# Altium schematic sheet obc-v2_CM4-PinOut.SchDoc
size 420 x 297 mm; SheetNumber: 14; SheetTotal: 21
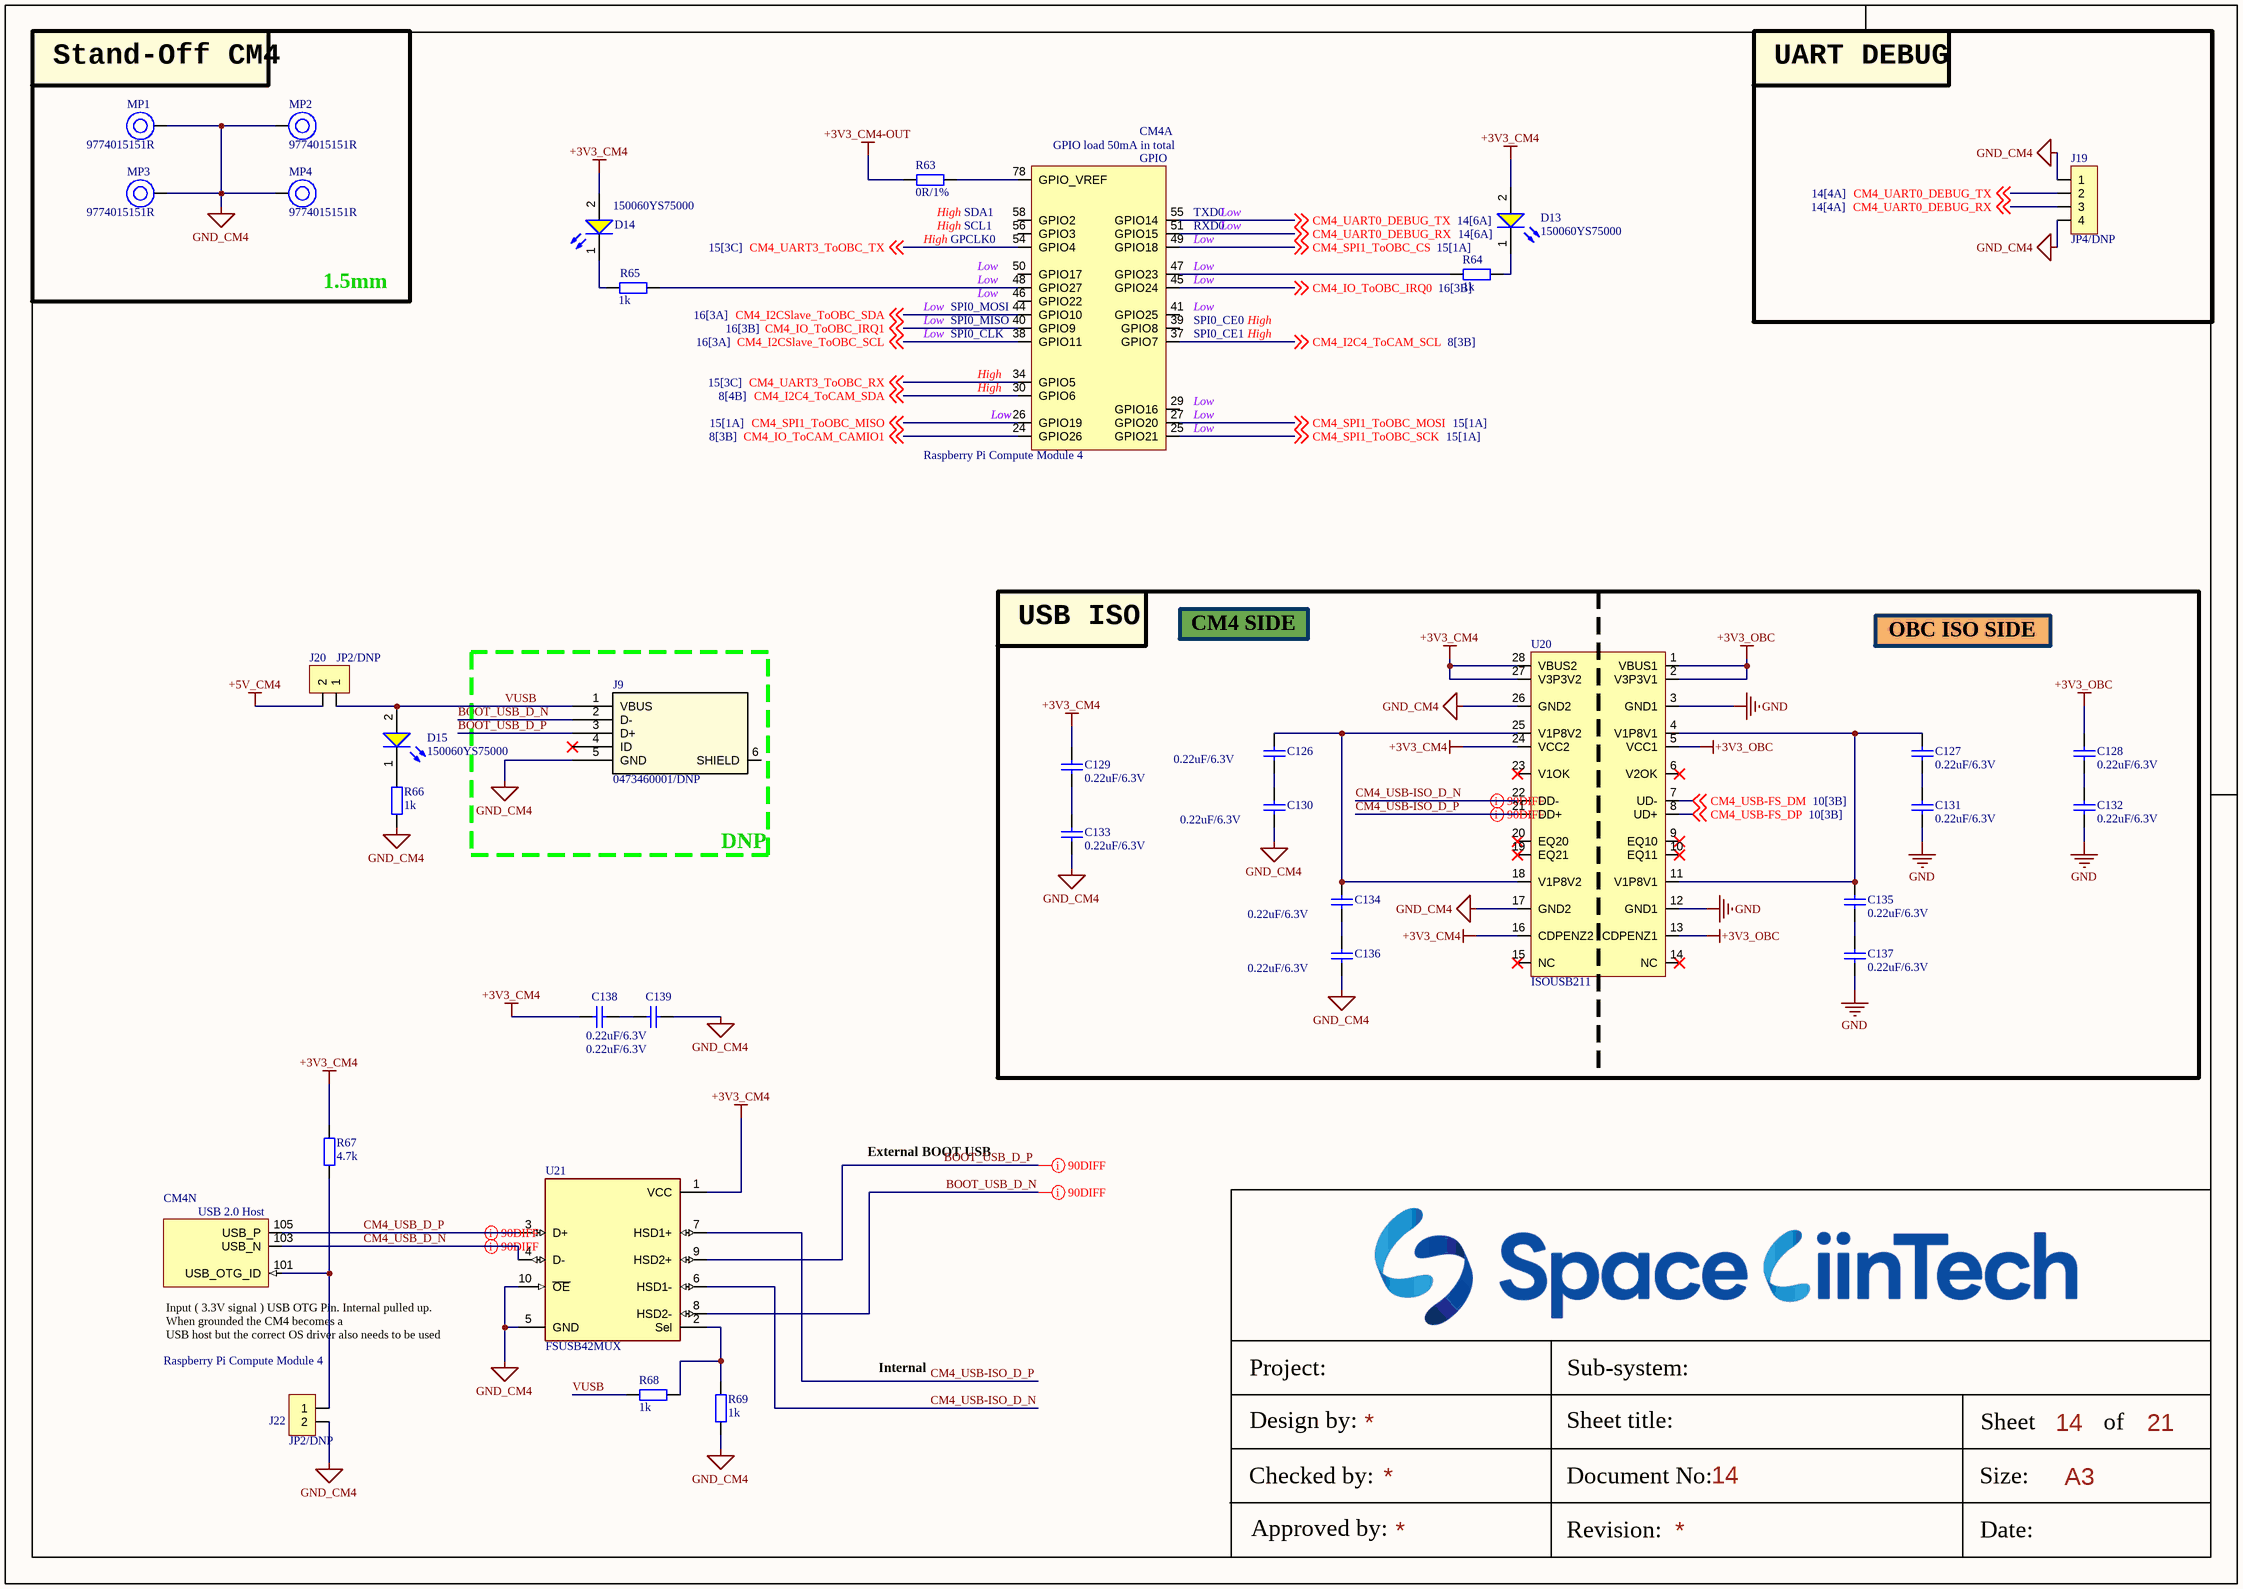
[diagram p0: obc-v2_CM4-PinOut.SchDoc]

## Parts
C126  0.22uF/6.3V  [CAP_C_1005X60]
C127  0.22uF/6.3V  [CAP_C_1005X60]
C128  0.22uF/6.3V  [CAP_C_1005X60]
C129  0.22uF/6.3V  [CAP_C_1005X60]
C130  0.22uF/6.3V  [CAP_C_1005X60]
C131  0.22uF/6.3V  [CAP_C_1005X60]
C132  0.22uF/6.3V  [CAP_C_1005X60]
C133  0.22uF/6.3V  [CAP_C_1005X60]
C134  0.22uF/6.3V  [CAP_C_1005X60]
C135  0.22uF/6.3V  [CAP_C_1005X60]
C136  0.22uF/6.3V  [CAP_C_1005X60]
C137  0.22uF/6.3V  [CAP_C_1005X60]
C138  0.22uF/6.3V  [CAP_C_1005X60]
C139  0.22uF/6.3V  [CAP_C_1005X60]
CM4  Raspberry Pi Compute Module 4  [CM4-DF40HC(3.0)-100DS-0.4v_3mm_1.5mm]  (parts A,N of 21)  (no BOM)
D13  150060YS75000  [WL-SMCW_0603_150060xx75000]
D14  150060YS75000  [WL-SMCW_0603_150060xx75000]
D15  150060YS75000  [WL-SMCW_0603_150060xx75000]
J9  0473460001/DNP  [47346-0001_MOL]
J19  JP4/DNP  [JP4-C1T]
J20  JP2/DNP  [JP2-D1T]
J22  JP2/DNP  [JP2-D1T]
MP1  9774015151R  [9774015151]
MP2  9774015151R  [9774015151]
MP3  9774015151R  [9774015151]
MP4  9774015151R  [9774015151]
R63  0R/1%  [RES_C_1608X60]
R64  1k  [RES_C_1608X60]
R65  1k  [RES_C_1608X60]
R66  1k  [RES_C_1608X60]
R67  4.7k  [RES_C_1608X60]
R68  1k  [RES_C_1608X60]
R69  1k  [RES_C_1608X60]
U20  ISOUSB211  [BSSOP_65P_750W_28]
U21  FSUSB42MUX  [FP-846AP-MFG]

## Blocks framed on the sheet
Stand-Off CM4: MP1-MP4
UART DEBUG: J19
USB ISO: C126-C137 U20
DNP: J9

## Nets
+3V3_CM4: C129.1 C138.1 D13.2(A) D14.2(A) R67.1 U20.16(CDPENZ2) U20.24(VCC2) U20.27(V3P3V2) U20.28(VBUS2) U21.1(VCC)
+3V3_CM4-OUT: R63.1
+3V3_OBC: C128.1 U20.1(VBUS1) U20.2(V3P3V1) U20.5(VCC1) U20.13(CDPENZ1)
+5V_CM4: J20.2
GND: C131.2 C132.2 C137.2 U20.3(GND1) U20.12(GND1)
GND_CM4: C130.2 C133.2 C136.2 C139.2 J9.5(GND) J19.1 J19.4 J22.2 MP1.1 MP2.1 MP3.1 MP4.1 R66.2 R69.2 U20.17(GND2) U20.26(GND2) U21.5(GND) U21.10(~{OE})
BOOT_USB_D_N: J9.2(D-) U21.8(HSD2-)
BOOT_USB_D_P: J9.3(D+) U21.9(HSD2+)
CM4_I2C4_ToCAM_SCL: CM4.37(GPIO7) ; off-sheet CM4_I2C4_ToCAM_SCL
CM4_I2C4_ToCAM_SDA: CM4.30(GPIO6) ; off-sheet CM4_I2C4_ToCAM_SDA
CM4_I2CSlave_ToOBC_SCL: CM4.38(GPIO11) ; off-sheet CM4_I2CSlave_ToOBC_SCL
CM4_I2CSlave_ToOBC_SDA: CM4.44(GPIO10) ; off-sheet CM4_I2CSlave_ToOBC_SDA
CM4_IO_ToCAM_CAMIO1: CM4.24(GPIO26) ; off-sheet CM4_IO_ToCAM_CAMIO1
CM4_IO_ToOBC_IRQ0: CM4.45(GPIO24) ; off-sheet CM4_IO_ToOBC_IRQ0
CM4_IO_ToOBC_IRQ1: CM4.40(GPIO9) ; off-sheet CM4_IO_ToOBC_IRQ1
CM4_SPI1_ToOBC_CS: CM4.49(GPIO18) ; off-sheet CM4_SPI1_ToOBC_CS
CM4_SPI1_ToOBC_MISO: CM4.26(GPIO19) ; off-sheet CM4_SPI1_ToOBC_MISO
CM4_SPI1_ToOBC_MOSI: CM4.27(GPIO20) ; off-sheet CM4_SPI1_ToOBC_MOSI
CM4_SPI1_ToOBC_SCK: CM4.25(GPIO21) ; off-sheet CM4_SPI1_ToOBC_SCK
CM4_UART0_DEBUG_RX: CM4.51(GPIO15) J19.3 ; off-sheet CM4_UART0_DEBUG_RX
CM4_UART0_DEBUG_TX: CM4.55(GPIO14) J19.2 ; off-sheet CM4_UART0_DEBUG_TX
CM4_UART3_ToOBC_RX: CM4.34(GPIO5) ; off-sheet CM4_UART3_ToOBC_RX
CM4_UART3_ToOBC_TX: CM4.54(GPIO4) ; off-sheet CM4_UART3_ToOBC_TX
CM4_USB-FS_DM: U20.7(UD-) ; off-sheet CM4_USB-FS_DM
CM4_USB-FS_DP: U20.8(UD+) ; off-sheet CM4_USB-FS_DP
CM4_USB-ISO_D_N: U20.22(DD-) U21.6(HSD1-)
CM4_USB-ISO_D_P: U20.21(DD+) U21.7(HSD1+)
CM4_USB_D_N: CM4.103(USB_N) U21.4(D-)
CM4_USB_D_P: CM4.105(USB_P) U21.3(D+)
VUSB: D15.2(A) J9.1(VBUS) J20.1 R68.1
NetC126_1: C126.1 C134.1 U20.18(V1P8V2) U20.25(V1P8V2)
NetC126_2: C126.2 C130.1
NetC127_1: C127.1 C135.1 U20.4(V1P8V1) U20.11(V1P8V1)
NetC127_2: C127.2 C131.1
NetC128_2: C128.2 C132.1
NetC129_2: C129.2 C133.1
NetC134_2: C134.2 C136.1
NetC135_2: C135.2 C137.1
NetC138_2: C138.2 C139.1
NetCM4_47: CM4.47(GPIO23) R64.2
NetCM4_48: CM4.48(GPIO27) R65.2
NetCM4_78: CM4.78(GPIO_VREF) R63.2
NetCM4_101: CM4.101(USB_OTG_ID) J22.1 R67.2
NetD13_1: D13.1(K) R64.1
NetD14_1: D14.1(K) R65.1
NetD15_1: D15.1(K) R66.1
NetR68_2: R68.2 R69.1 U21.2(Sel)

Not connected (* = marked no-connect by the designer): CM4 29(GPIO16) 39(GPIO8) 41(GPIO25) 46(GPIO22) 50(GPIO17) 56(GPIO3) 58(GPIO2); J9 4(ID)* 6(SHIELD); U20 6(V2OK)* 9(EQ10)* 10(EQ11)* 14(NC)* 15(NC)* 19(EQ21)* 20(EQ20)* 23(V1OK)*

## Layout directives
differential pair; differential pair class DIFF90: BOOT_USB_D_N, BOOT_USB_D_P, CM4_USB-ISO_D_N, CM4_USB-ISO_D_P, CM4_USB_D_N, CM4_USB_D_P

## Notes on the sheet
- 1.5mm
- CM4 SIDE
- OBC ISO SIDE
- External BOOT USB
- Internal
- Project:
- Sub-system:
- Design by:
- Sheet title:
- Sheet
- A3
- of
- Checked by:
- Approved by:
- Revision:
- Document No:
- Size:
- Date:
- (in symbol CM4, part A) GPIO load 50mA in total; GPIO; High; SDA1; TXD0; Low; SCL1; RXD0; GPCLK0; SPI0_MOSI; SPI0_MISO; SPI0_CE0; SPI0_CLK; SPI0_CE1; by Amornthep Phunsin
- (in symbol CM4, part N) USB 2.0 Host; Input ( 3.3V signal ) USB OTG Pin. Internal pulled up. When grounded the CM4 becomes a / USB host but the correct OS driver also needs to be used

## Library data of the parts
C126-C139 = Tu 0402 33nF 10V: CAPC; Chung_Loai: Dán; Don_Vi: Con; So_Chan: 2; Ten_Linh_Kien: Tụ 0402 33nF X7R 10V GRM155R71A333KA01D; Ma_Hang: MH007853; Kieu_Chan: *
CM4 = CM4: Raspberry Pi Compute Module 4 by Amornthep Phunsin
D13-D15 = CMP-1426-00005-2: LED YELLOW CLEAR 0603 SMD; NexarPartId: 29687085; Wavelength: 590nm; Luminous Intensity: 120mcd; Peak Wavelength: 595nm; Forward Current: 100mA; Power Dissipation: 72mW; Forward Voltage: 2V; Test Current: 20mA; Reverse Voltage: 5V; Lens Style: Clear, Rectangular; Max Junction Temperature (Tj): 95°C; Viewing Angle: 140°; Case Code (Imperial): 0603; Height: 700µm; REACH SVHC: Unknown; Dominant Wavelength: 590nm; Min Operating Temperature: -40°C; Color: Yellow; Width: 800µm; Mount: Surface Mount; Packaging: Tape and Reel; Max Operating Temperature: 85°C; RoHS: Compliant; Max Reverse Voltage (DC): 5V; Case Code (Metric): 1608; Length: 1.6mm; Case/Package: 0603
J9 = USB_micro: No Description Available; Mfr_Name: Molex Connector Corporation; RefDes: RefDes; Type: Type
J19 = JP4: WR-PHD 2.54 mm Angled Socket Header; Manufacturer: W¨¹rth Elektronik eiSos GmbH; partNo: 613004143121; ComponentLink1 Description: Manufacturer; ComponentLink2 Description: Datasheet; NoPins: 04; Created Date: 29 March 2013; ComponentLink1URL: http://www.we-online.com; ComponentLink2URL: http://katalog.we-online.de/em/datasheet/6130xx143121.pdf; Created by: Karrer Zheng
J20 J22 = JP2: WR-PHD 2.54 mm Angled Socket Header; Manufacturer: W¨¹rth Elektronik eiSos GmbH; partNo: 613002143121; ComponentLink1 Description: Manufacturer; ComponentLink2 Description: Datasheet; NoPins: 02; Created Date: 29 March 2013; ComponentLink1URL: http://www.we-online.com; ComponentLink2URL: http://katalog.we-online.de/em/datasheet/6130xx143121.pdf; Created by: Karrer Zheng
MP1-MP4 = CMP-03913-59774846-1: 9774015151R WA-SMSI SMT Steel Spacer, M2.5 Internal non Stop; Plating: Tin; Outside Diameter: 5.1054mm; Threaded/Unthreaded: Threaded; Length: 1.5mm; Packaging: Tape and Reel; NexarPartId: 59774846; Min Operating Temperature: -55°C; Height: 1.6mm; Material: Steel; REACH SVHC: Unknown; Max Operating Temperature: 150°C; RoHS: Compliant
R63-R69 = Tro 0603 1% 10k: RES; Chung_Loai: Dán; Don_Vi: Con; So_Chan: 2; Ten_Linh_Kien: Trở 0603 1% 10k; Ma_Hang: MH006333; Kieu_Chan: *
U21 = CMP-07103-000004-1: IC USB SWITCH DPDT 10MSOP; Voltage: 4.3V; Current: 100mA; Number of Inputs: 2; Supply Type: Single; Number of Outputs: 4; Data Rate: 480Mbps; On-State Resistance: 6.5R; Min Supply Voltage: 3V; Package Quantity: 1; Length: 3mm; Radiation Hardening: No; Number of Pins: 10; Width: 3mm; Number of Channels: 2; REACH SVHC: No SVHC; Lead Free: Lead Free; Max Operating Temperature: 85°C; Min Operating Temperature: -40°C; Packaging: Tape and Reel; Throw Configuration: DPDT; Operating Supply Voltage: 4.3V; Max Supply Voltage: 4.3V; Mount: Surface Mount; Case/Package: MSOP; Weight: 0.1125g; Height: 0.85mm